# EAGLE design CAN-BT (EAGLE 7.5.0)
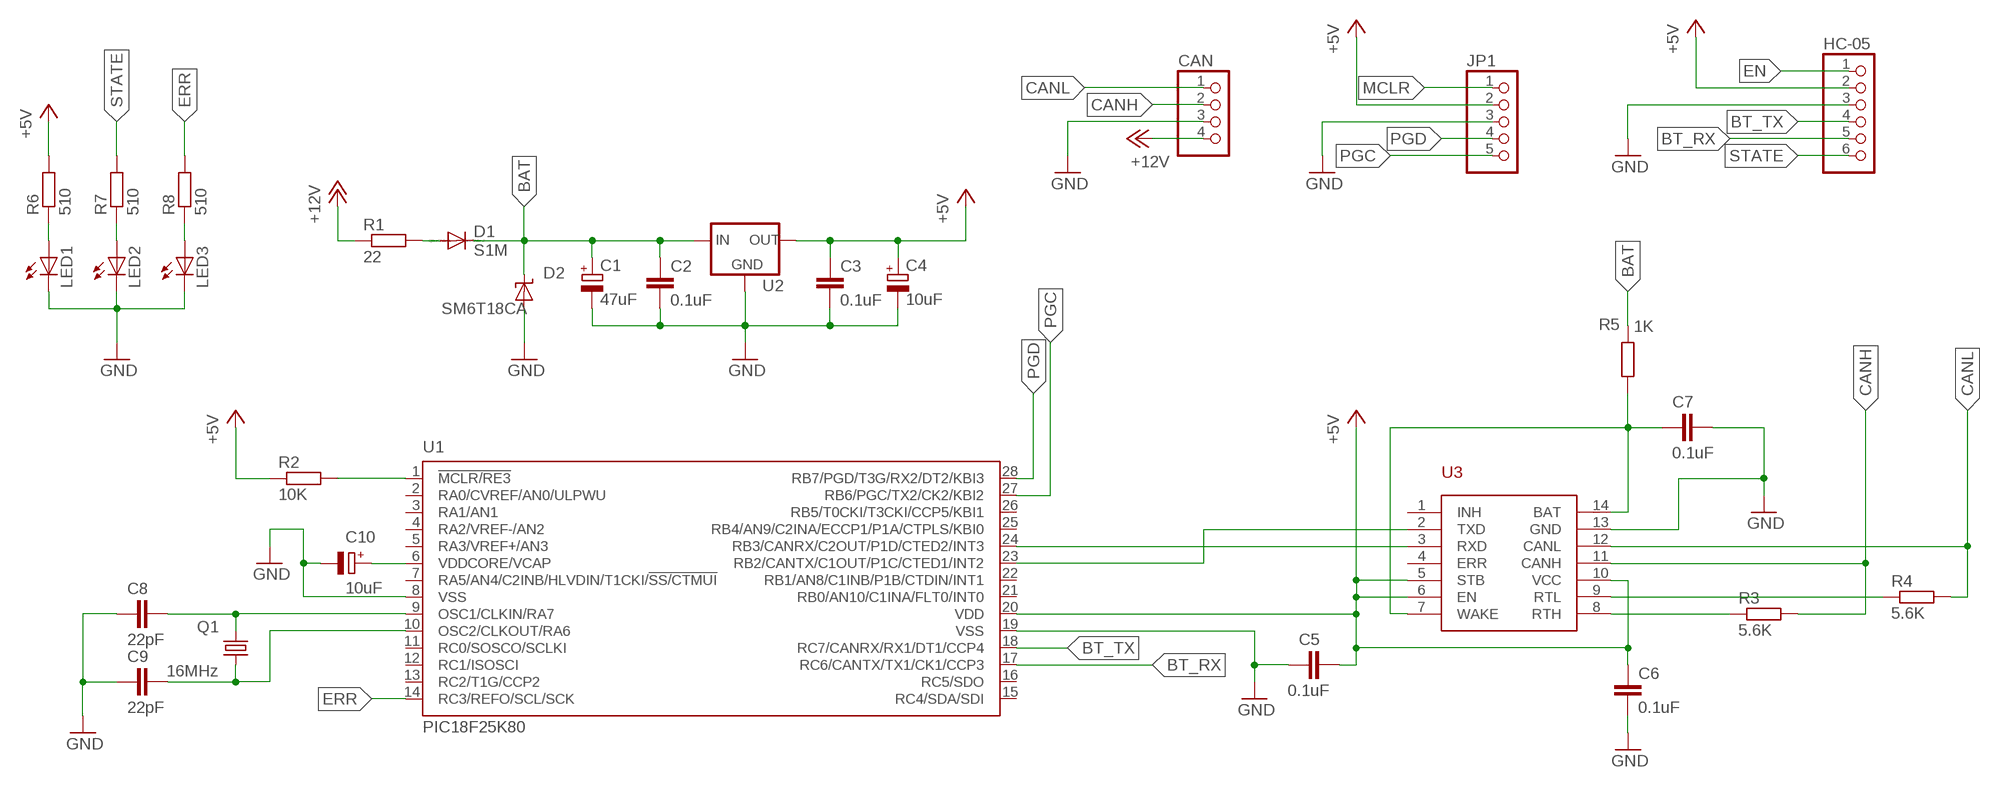
[diagram p0: schematic, sheet 1]

## Parts
C1  47uF  CPOL-EU153CLV-0807  [153CLV-0807]
C2  0.1uF  C-EUC0805  [C0805]
C3  0.1uF  C-EUC0805  [C0805]
C4  10uF  CPOL-EU153CLV-0605  [153CLV-0605]
C5  0.1uF  C-EUC0805  [C0805]
C6  0.1uF  C-EUC0805  [C0805]
C7  0.1uF  C-EUC0805  [C0805]
C8  22pF  C-EUC0805  [C0805]
C9  22pF  C-EUC0805  [C0805]
C10  10uF  CPOL-EUSMCA  [SMC_A]
CAN  PINHD-1X4  [1X04]
D1  S1M  [SMA]
D2  SM6T18CA  SUPPRESSOR-SMBJ  [SMBJ]
HC-05  PINHD-1X6  [1X06]
JP1  PINHD-1X5  [1X05]
LED1  LEDSQR2X5  [LED2X5]
LED2  LEDSQR2X5  [LED2X5]
LED3  LEDSQR2X5  [LED2X5]
Q1  16MHz  CRYSTALHC49S  [HC49/S]
R1  22  R-EU_M1206  [M1206]
R2  10K  R-EU_R0805  [R0805]
R3  5.6K  R-EU_R0805  [R0805]
R4  5.6K  R-EU_R0805  [R0805]
R5  1K  R-EU_R0805  [R0805]
R6  510  R-EU_R0805  [R0805]
R7  510  R-EU_R0805  [R0805]
R8  510  R-EU_R0805  [R0805]
U1  PIC18F25K80  [SO28W]
U2  78M05  [DPACK]
U3  TJA1055T  [SO-14W]

## Nets
+5V: C3.1 C4.+ C5.1 C6.1 HC-05.2 JP1.2 R2.1 R6.2 U1.20(VDD) U2.3(OUT) U3.5(STB) U3.6(EN) U3.10(VCC)
+12V: CAN.4 R1.1
BAT: C1.+ C2.1 D1.C D2.C R5.2 U2.1(IN)
BT_RX: HC-05.5 U1.17(RC6/CANTX/TX1/CK1/CCP3)
BT_TX: HC-05.4 U1.18(RC7/CANRX/RX1/DT1/CCP4)
CANH: CAN.2 R3.2 U3.11(CANH)
CANL: CAN.1 R4.2 U3.12(CANL)
EN: HC-05.1
ERR: R8.2 U1.14(RC3/REFO/SCL/SCK)
GND: C1.- C2.2 C3.2 C4.- C5.2 C6.2 C7.2 C8.1 C9.1 C10.- CAN.3 D2.A HC-05.3 JP1.3 LED1.K(C) LED2.K(C) LED3.K(C) U1.8(VSS) U1.19(VSS) U2.4(GND) U3.13(GND)
MCLR: JP1.1
N$1: D1.A R1.2
N$2: U1.23(RB2/CANTX/C1OUT/P1C/CTED1/INT2) U3.2(TXD)
N$3: U1.24(RB3/CANRX/C2OUT/P1D/CTED2/INT3) U3.3(RXD)
N$4: R2.2 U1.1(!MCLR/RE3)
N$5: C8.2 Q1.1 U1.9(OSC1/CLKIN/RA7)
N$6: C7.1 R5.1 U3.7(WAKE) U3.14(BAT)
N$7: C9.2 Q1.2 U1.10(OSC2/CLKOUT/RA6)
N$8: C10.+ U1.6(VDDCORE/VCAP)
N$9: LED3.A R8.1
N$10: LED1.A R6.1
N$11: R3.1 U3.8(RTH)
N$12: R4.1 U3.9(RTL)
N$13: LED2.A R7.1
PGC: JP1.5 U1.27(RB6/PGC/TX2/CK2/KBI2)
PGD: JP1.4 U1.28(RB7/PGD/T3G/RX2/DT2/KBI3)
STATE: HC-05.6 R7.2
Unconnected: U1.2(RA0/CVREF/AN0/ULPWU) U1.3(RA1/AN1) U1.4(RA2/VREF-/AN2) U1.5(RA3/VREF+/AN3) U1.7(RA5/AN4/C2INB/HLVDIN/T1CKI/!SS/CTMUI) U1.11(RC0/SOSCO/SCLKI) U1.12(RC1/ISOSCI) U1.13(RC2/T1G/CCP2) U1.15(RC4/SDA/SDI) U1.16(RC5/SDO) U1.21(RB0/AN10/C1INA/FLT0/INT0) U1.22(RB1/AN8/C1INB/P1B/CTDIN/INT1) U1.25(RB4/AN9/C2INA/ECCP1/P1A/CTPLS/KBI0) U1.26(RB5/T0CKI/T3CKI/CCP5/KBI1) U3.1(INH) U3.4(ERR)

## Library data of the parts
C1 C4 C10 = rcl:CPOL-EU: POLARIZED CAPACITOR, European symbol
C2 C3 C5-C9 = rcl:C-EU: CAPACITOR, European symbol
CAN = Park-A:PINHD-1X4: PIN HEADER
D1 = diode:S1M
D2 = diode:SUPPRESSOR-: Suppressor diode
HC-05 = CAN-BT:PINHD-1X6: PIN HEADER
JP1 = CAN-BT:PINHD-1X5: PIN HEADER
LED1-LED3 = CAN-BT:LED: LED OSRAM: - CHIPLED LG R971, LG N971, LY N971, LG Q971, LY Q971, LO R971, LY R971 LH N974, LH R974 LS Q976, LO Q976, LY Q976 LO Q996 - Hyper CHIPLED LW Q18S LB Q993, LB Q99A, LB R99A - SideLED LS A670, LO A670, LY A670, LG A670, LP A670 LB A673, LV A673, LT A673, LW A673 LH A674 LY A675 LS A676, LA A676, LO A676, LY A676, LW A676 LS A679, LY A679, LG A679 - Hyper Micro SIDELED® LS Y876, LA Y876, LO Y876, LY Y876 LT Y87S - SmartLED LW L88C, LW L88S LB L89C, LB L89S, LG L890 LS L89K, LO L89K, LY L89K LS L896, LA L896, LO L896, LY L896 - TOPLED LS T670, LO T670, LY T670, LG T670, LP T670 LSG T670, LSP T670, LSY T670, LOP T670, LYG T670 LG T671, LOG T671, LSG T671 LB T673, LV T673, LT T673, LW T673 LH T674 LS T676, LA T676, LO T676, LY T676, LB T676, LH T676, LSB T676, LW T676 LB T67C, LV T67C, LT T67C, LS T67K, LO T67K, LY T67K, LW E67C LS E67B, LA E67B, LO E67B, LY E67B, LB E67C, LV E67C, LT E67C LW T67C LS T679, LY T679, LG T679 LS T770, LO T770, LY T770, LG T770, LP T770 LB T773, LV T773, LT T773, LW T773 LH T774 LS E675, LA E675, LY E675, LS T675 LS T776, LA T776, LO T776, LY T776, LB T776 LHGB T686 LT T68C, LB T68C - Hyper Mini TOPLED® LB M676 - Mini TOPLED Santana® LG M470 LS M47K, LO M47K, LY M47K Source: http://www.osram.convergy.de LUXEON: - LUMILED® LXK2-PW12-R00, LXK2-PW12-S00, LXK2-PW14-U00, LXK2-PW14-V00 LXK2-PM12-R00, LXK2-PM12-S00, LXK2-PM14-U00 LXK2-PE12-Q00, LXK2-PE12-R00, LXK2-PE12-S00, LXK2-PE14-T00, LXK2-PE14-U00 LXK2-PB12-K00, LXK2-PB12-L00, LXK2-PB12-M00, LXK2-PB14-N00, LXK2-PB14-P00, LXK2-PB14-Q00 LXK2-PR12-L00, LXK2-PR12-M00, LXK2-PR14-Q00, LXK2-PR14-R00 LXK2-PD12-Q00, LXK2-PD12-R00, LXK2-PD12-S00 LXK2-PH12-R00, LXK2-PH12-S00 LXK2-PL12-P00, LXK2-PL12-Q00, LXK2-PL12-R00 Source: www.luxeon.com KINGBRIGHT: KA-3528ASYC Source: www.kingbright.com
Q1 = Park-A:CRYSTAL: CRYSTAL; OC_FARNELL: 1667008; OC_NEWARK: unknown
R1-R8 = rcl:R-EU_: RESISTOR, European symbol
U1 = Park-A:PIC18F25K80
U2 = Park-A:78M05
U3 = Park-A:TJA1055T

## Board
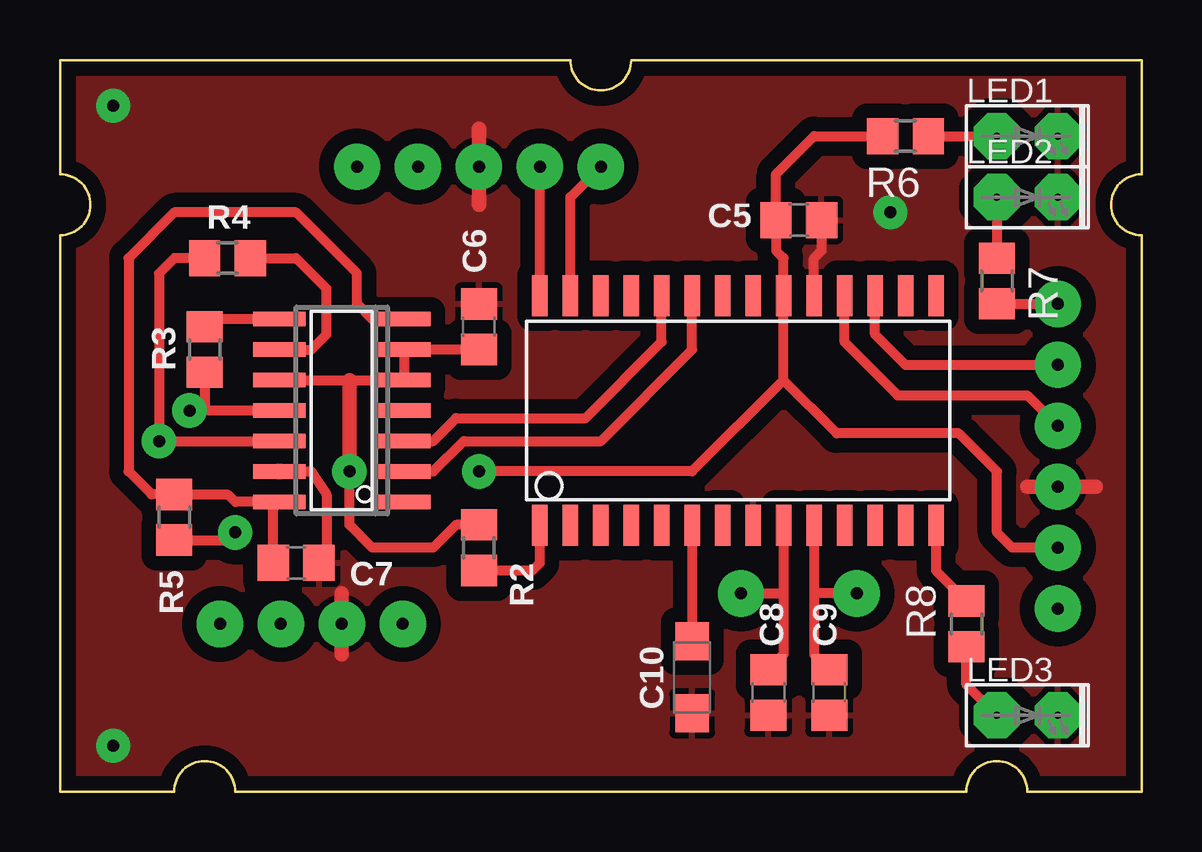
[diagram p1: board, top side]
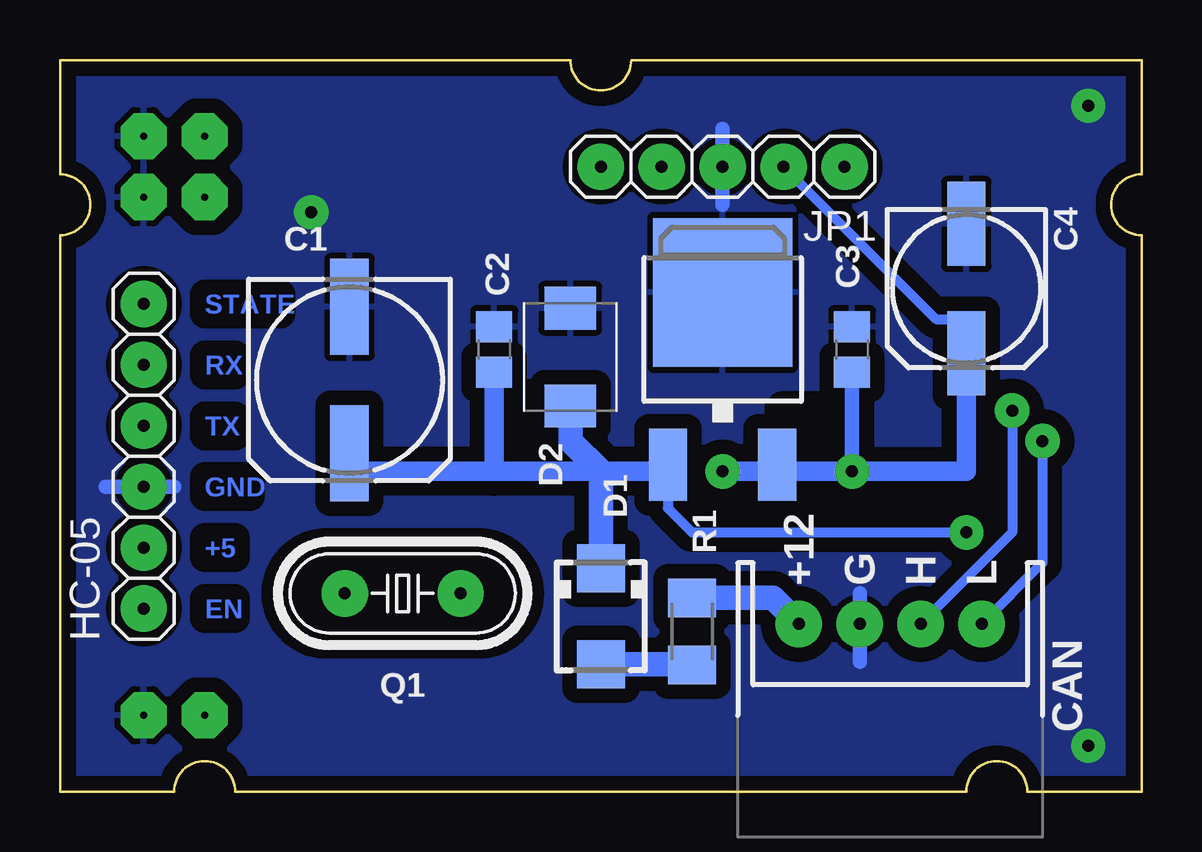
[diagram p2: board, bottom side, seen from below]

Size 45.08 x 30.48 mm. Coordinates in mm from the lower left corner, seen from the top.
Outline: 23.81,30.48 arc-180 21.27,30.48 0,30.48 0,25.72 arc-180 0,23.18 0,0 4.76,0 arc-180 7.3,0 37.78,0 arc-180 40.32,0 45.08,0 45.08,23.18 arc-180 45.08,25.72 45.08,30.48 23.81,30.48
Copper layers (1*16): Top 0.035mm / dielectric 1.5mm / Bottom 0.035mm
Design rules "ITEADstudio_DRC *": minimum track width 6mil, minimum drill 12mil, track to track 6mil, track to pad 6mil, pad to pad 6mil, via to via 6mil, smd to smd 0mil, copper to edge 10mil, drill to drill 10mil, minimum pad ring 10mil, minimum via ring 6mil, stop-mask expansion 2mil, vias tented up to drill 100mil, thermal gap 10mil
tRestrict: 6 lines
bRestrict: 5 lines

### Footprints (pad centres in the part's own frame; a part is rotated, then mirrored left to right if it is on the bottom)
153CLV-0807 = smd 4 x 1.6: + 3.05,0; - -3.05,0
C0805 = smd 1.3 x 1.5: 1 -0.95,0; 2 0.95,0
153CLV-0605 = smd 3.5 x 1.6: + 2.7,0; - -2.7,0
SMC_A = smd 1.6 x 1.4: + -1.5,0; - 1.5,0
1X04 = drill 0.5 pad 1.93: 1 -3.81,0; 2 -1.27,0; 3 1.27,0; 4 3.81,0
SMA = smd 2 x 2: A 2,0; C -2,0
SMBJ = smd 1.78 x 2.16: A 2.04,0; C -2.03,0
1X06 = drill 0.5 pad 1.93: 1 -6.35,0; 2 -3.81,0; 3 -1.27,0; 4 1.27,0; 5 3.81,0; 6 6.35,0
1X05 = drill 0.5 pad 1.93: 1 -5.08,0; 2 -2.54,0; 3 0,0; 4 2.54,0; 5 5.08,0
LED2X5 = drill 0.3 pad 1.93 octagon: A -1.27,0; K 1.27,0
HC49/S = drill 0.5 pad 1.93: 1 -2.413,0; 2 2.413,0
M1206 = smd 1.6 x 2: 1 -1.4,0; 2 1.4,0
R0805 = smd 1.3 x 1.5: 1 -0.95,0; 2 0.95,0
SO28W = smd 0.65 x 1.7: 1 -7.62,-4.78; 2 -6.35,-4.78; 3 -5.08,-4.78; 4 -3.81,-4.78; 5 -2.54,-4.78; 6 -1.27,-4.78; 7 0,-4.78; 8 1.27,-4.78; 9 2.54,-4.78; 10 3.81,-4.78; 11 5.08,-4.78; 12 6.35,-4.78; 13 7.62,-4.78; 14 8.89,-4.78; 15 8.89,4.78; 16 7.62,4.78; 17 6.35,4.78; 18 5.08,4.78; 19 3.81,4.78; 20 2.54,4.78; 21 1.27,4.78; 22 0,4.78; 23 -1.27,4.78; 24 -2.54,4.78; 25 -3.81,4.78; 26 -5.08,4.78; 27 -6.35,4.78; 28 -7.62,4.78
DPACK = smd 1.6 x 3: 1 -2.28,-4.8; 3 2.28,-4.8 | smd 5.8 x 6.2: 4 0,2.38
SO-14W = smd 0.6 x 2.2: 1 -3.81,-2.6; 2 -2.54,-2.6; 3 -1.27,-2.6; 4 0,-2.6; 5 1.27,-2.6; 6 2.54,-2.6; 7 3.81,-2.6; 8 3.81,2.6; 9 2.54,2.6; 10 1.27,2.6; 11 0,2.6; 12 -1.27,2.6; 13 -2.54,2.6; 14 -3.81,2.6

### Placement (x,y rotation side)
C1  33.02,17.15 270 bottom
C2  26.99,18.41 90 bottom
C3  12.07,18.41 90 bottom
C4  7.3,20.95 270 bottom
C5  30.8,23.81 0 top
C6  17.46,19.37 90 top
C7  9.84,9.52 0 top
C8  29.53,4.13 90 top
C9  32.07,4.13 90 top
C10  26.35,4.76 270 top
CAN  10.48,6.98 180 bottom
D1  22.54,7.3 270 bottom
D2  23.81,18.1 90 bottom
HC-05  41.59,13.97 90 bottom
JP1  17.46,26.03 180 bottom
LED1  40.32,27.31 0 top
LED2  40.32,24.77 0 top
LED3  40.32,3.17 0 top
Q1  30.8,8.26 180 bottom
R1  18.73,6.67 270 bottom
R2  17.46,10.16 270 top
R3  6.03,18.41 270 top
R4  6.98,22.23 180 top
R5  4.76,11.43 270 top
R6  35.24,27.31 180 top
R7  39.05,21.27 270 top
R8  37.78,6.98 90 top
U1  27.62,15.88 0 top
U2  17.46,18.41 0 bottom
U3  11.75,15.88 90 top

### Tracks (layer width: path | path; a pad name or v marks a point on that pad's centre or on a via)
+5V  (via drill 0.5 pad 1.42)
  Top 0.406: v12.07,13.34 12.07,11.11 13.02,10.16 15.56,10.16 16.51,11.11 R2.1 | 30.16,17.15 U1.20 30.16,22.23 29.85,22.54 C5.1 29.85,25.72 31.43,27.31 R6.2 | U3.10 12.07,17.15 U3.5 U3.6 C6.1 | 30.16,17.15 26.35,13.34 v17.46,13.34 | 30.16,17.15 32.39,14.92 37.46,14.92 39.05,13.34 39.05,10.8 39.69,10.16 HC-05.2
  Top 0.61: 12.07,17.15 v12.07,13.34
  Bottom 0.406: JP1.2 8.57,19.69 7.3,19.69 C4.+
  Bottom 0.61: C3.1 v12.07,13.34
  Bottom 0.813: C4.+ 7.3,13.34 v12.07,13.34 14.92,13.34 15.18,13.59 U2.3 15.46,13.34 v17.46,13.34
+12V
  Bottom 1.016: CAN.4 15.37,8.07 R1.1
BAT  (via drill 0.5 pad 1.42)
  Top 0.406: R5.2 6.99,10.48 v7.3,10.8
  Bottom 0.406: U2.1 19.74,11.8 18.73,10.8 v7.3,10.8
  Bottom 0.813: U2.1 20.1,13.34 22.54,13.34 26.99,13.34 | 26.99,13.34 32.7,13.34 C1.+ | C2.1 26.99,13.34
  Bottom 1.016: D1.C 22.54,13.34 23.81,14.61 D2.C
BT_RX
  Top 0.406: U1.17 33.97,19.05 35.24,17.78 HC-05.5
BT_TX
  Top 0.406: U1.18 32.7,18.73 34.92,16.51 40.32,16.51 HC-05.4
CANH  (via drill 0.5 pad 1.42)
  Top 0.406: U3.11 6.03,15.88 | 6.03,15.88 v5.4,15.88 | R3.2 6.03,15.88
  Bottom 0.406: v5.4,15.88 5.4,10.8 CAN.2
CANL  (via drill 0.5 pad 1.42)
  Top 0.406: R4.2 4.76,22.23 4.13,21.59 v4.13,14.61 U3.12
  Bottom 0.406: v4.13,14.61 4.13,9.52 CAN.1
ERR
  Top 0.406: U1.14 36.51,9.21 R8.2
GND  (via drill 0.5 pad 1.42)
  Top 0.406: U3.13 10.48,13.34 11.11,12.38 11.11,9.52 C7.2 | U1.19 31.43,22.23 31.75,22.54 C5.2
  Top 0.61: 43.18,12.7 40.32,12.7 | 17.46,27.62 17.46,24.45 | 11.75,5.72 11.75,8.26
  Bottom 0.61: 17.46,27.62 17.46,24.45 | 11.75,8.26 11.75,5.4 | 43.18,12.7 40.32,12.7
  other vias: 2.22,28.58 2.22,1.91 34.61,24.13
  pour Top (isolate 0.61): -23.18,37.47 51.75,37.47 51.75,-3.17 -23.18,-3.17
  pour Bottom (isolate 0.61): -21.91,34.92 49.21,34.92 49.21,-1.91 -21.91,-1.91
N$1
  Bottom 1.016: R1.2 18.77,5.3 D1.A
N$2
  Top 0.406: U3.2 15.56,13.34 16.83,14.61 22.54,14.61 26.35,18.41 U1.23
N$3
  Top 0.406: U3.3 15.56,14.61 16.51,15.56 21.91,15.56 25.08,18.73 U1.24
N$4
  Top 0.406: R2.2 19.69,9.21 20,9.52 U1.1
N$5
  Top 0.406: U1.9 30.16,8.26 | 30.16,8.26 30.16,5.71 C8.2 | Q1.1 30.16,8.26
N$6
  Top 0.406: U3.7 13.02,19.69 12.38,20.32 12.38,21.59 9.84,24.13 4.76,24.13 2.86,22.23 2.86,13.34 3.81,12.38 R5.1 6.99,12.38 7.3,12.06 8.57,12.06 | U3.14 8.57,12.06 | C7.1 8.89,11.74 arc90 8.57,12.06
N$7
  Top 0.406: U1.10 31.43,8.26 | 31.43,8.26 31.43,5.71 C9.2 | Q1.2 31.43,8.26
N$8
  Top 0.406: U1.6 C10.+
N$9
  Top 0.406: LED3.A 37.78,4.45 R8.1
N$10
  Top 0.406: R6.1 LED1.A
N$11
  Top 0.406: U3.8 6.03,19.69 R3.1
N$12
  Top 0.406: U3.9 10.48,18.41 11.11,19.05 11.11,20.95 9.84,22.23 R4.1
N$13
  Top 0.406: LED2.A R7.1
PGC
  Top 0.406: U1.27 21.27,24.77 JP1.5
PGD
  Top 0.406: U1.28 JP1.4
STATE
  Top 0.406: R7.2 HC-05.6

### Text on the board
Bottom: STATE | RX | TX | GND | +5 | EN
bNames: L | H | G | +12